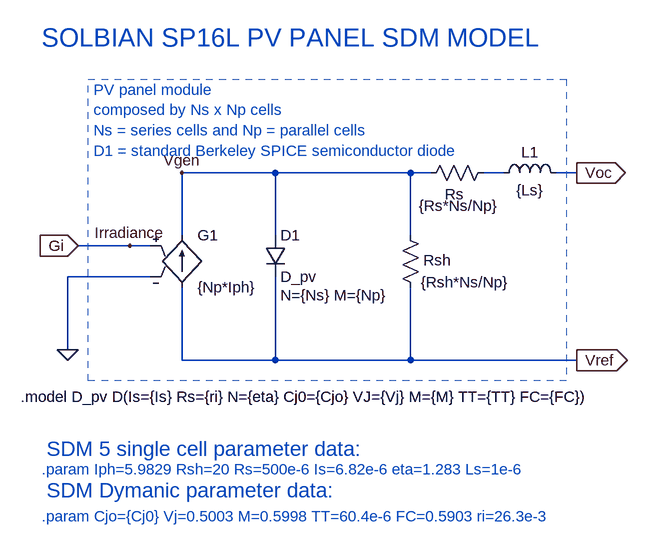
[diagram p0: schematic SDM_PV_model.asc]
SDM_PV_model.asc, the LTspice schematic file:
Version 4.1
SHEET 1 6688 1700
WIRE 416 528 272 528
WIRE 624 528 416 528
WIRE 656 528 624 528
WIRE 768 528 736 528
WIRE 880 528 848 528
WIRE 272 624 272 528
WIRE 416 624 416 528
WIRE 624 624 624 528
WIRE 192 640 112 640
WIRE 224 640 192 640
WIRE 224 688 96 688
WIRE 96 800 96 688
WIRE 272 816 272 704
WIRE 416 816 416 688
WIRE 416 816 272 816
WIRE 624 816 624 704
WIRE 624 816 416 816
WIRE 880 816 624 816
FLAG 880 528 Voc
IOPIN 880 528 Out
FLAG 112 640 Gi
IOPIN 112 640 In
FLAG 96 800 0
FLAG 880 816 Vref
IOPIN 880 816 Out
FLAG 192 640 Irradiance
FLAG 272 528 Vgen
SYMBOL diode 400 624 R0
WINDOW 123 24 92 Left 2
SYMATTR Value2 N={Ns} M={Np}
SYMATTR InstName D1
SYMATTR Value D_pv
SYMBOL g 272 608 R0
SYMATTR InstName G1
SYMATTR Value {Np*Iph}
SYMBOL res 608 608 R0
WINDOW 123 36 104 Left 2
WINDOW 0 36 54 Left 2
WINDOW 3 32 88 Left 2
SYMATTR InstName Rsh
SYMATTR Value {Rsh*Ns/Np}
SYMBOL res 640 544 R270
WINDOW 0 -1 52 VBottom 2
WINDOW 3 -50 58 VTop 2
WINDOW 123 60 56 VTop 2
SYMATTR InstName Rs
SYMATTR Value {Rs*Ns/Np}
SYMBOL ind 752 544 R270
WINDOW 0 32 56 VTop 2
WINDOW 3 5 56 VBottom 2
SYMATTR InstName L1
SYMATTR Value {Ls}
TEXT 24 872 Left 2 !.model D_pv D(Is={Is} Rs={ri} N={eta} Cj0={Cjo} VJ={Vj} M={M} TT={TT} FC={FC})
TEXT 136 400 Left 2 ;PV panel module\ncomposed by Ns x Np cells\nNs = series cells and Np = parallel cells\nD1 = standard Berkeley SPICE semiconductor diode
TEXT 56 320 Left 4 ;SOLBIAN SP16L PV PANEL SDM MODEL
TEXT 56 984 Left 2 ;.param Iph=5.9829 Rsh=20 Rs=500e-6 Is=6.82e-6 eta=1.283 Ls=1e-6
TEXT 56 1056 Left 2 ;.param Cjo={Cj0} Vj=0.5003 M=0.5998 TT=60.4e-6 FC=0.5903 ri=26.3e-3
TEXT 64 952 Left 3 ;SDM 5 single cell parameter data:
TEXT 64 1016 Left 3 ;SDM Dymanic parameter data:
RECTANGLE Normal 864 848 128 384 2

The netlist it stands for:
* SDM_PV_model.asc
D1 Vgen Vref D_pv N={Ns} M={Np}
G1 Vref Vgen Irradiance 0 {Np*Iph}
Rsh Vgen Vref {Rsh*Ns/Np}
Rs Vgen N001 {Rs*Ns/Np}
L1 N001 Voc {Ls}
.model D D
.lib standard.dio
.model D_pv D(Is={Is} Rs={ri} N={eta} Cj0={Cjo} VJ={Vj} M={M} TT={TT} FC={FC})
* PV panel module
* composed by Ns x Np cells
* Ns = series cells and Np = parallel cells
* D1 = standard Berkeley SPICE semiconductor diode
* SOLBIAN SP16L PV PANEL SDM MODEL
* .param Iph=5.9829 Rsh=20 Rs=500e-6 Is=6.82e-6 eta=1.283 Ls=1e-6
* .param Cjo={Cj0} Vj=0.5003 M=0.5998 TT=60.4e-6 FC=0.5903 ri=26.3e-3
* SDM 5 single cell parameter data:
* SDM Dymanic parameter data:
.backanno
.end